# Altium schematic sheet ADC_Interface.SchDoc
size A4; SheetNumber: 9; SheetTotal: 13
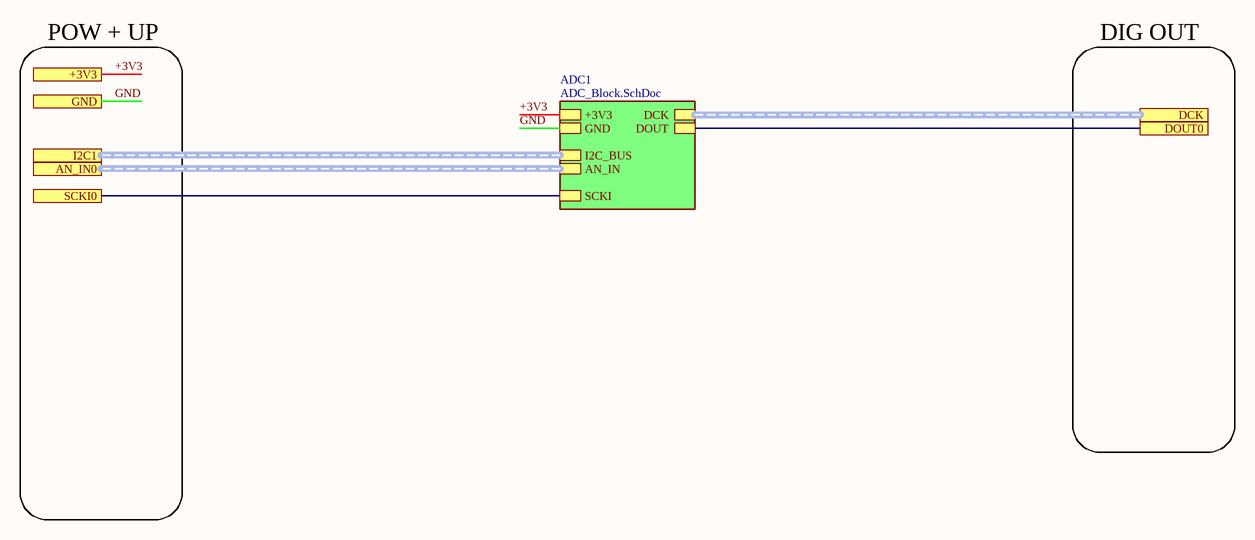
[diagram p0: ADC_Interface.SchDoc]

## Sub-sheets
ADC1 = ADC_Block.SchDoc: +3V3, GND, I2C_BUS (harness I2C), AN_IN (harness AN), SCKI, DCK (harness DCK), DOUT

## Ports
+3V3 (see AudioDSP-v3.0.0c_top[4B], ADC_Block[1A], CTRL_Connectors[1A], DAC_Block[1B], DSP_Block[1A], MCU_Block[1A], PLL_Block[1A], POW_Block[4B]), AN_IN0 (harness AN, see AudioDSP-v3.0.0c_top[4B]), DCK (harness DCK, see AudioDSP-v3.0.0c_top[4B], ADC_Block[4B]), DOUT0 (see AudioDSP-v3.0.0c_top[4B]), GND (see AudioDSP-v3.0.0c_top[4B], ADC_Block[1B], CTRL_Connectors[1A], DAC_Block[1B], DSP_Block[1A], IN_Connectors[3A], LPF_Block[1B], LPF_Interface[1B], MCU_Block[1B], OUT_Connectors[3B], PLL_Block[1A], POW_Block[1B]), I2C1 (harness I2C, see AudioDSP-v3.0.0c_top[4B]), SCKI0 (see AudioDSP-v3.0.0c_top[4B])

## Nets
+3V3: port +3V3, sheet ADC1/+3V3
DOUT0: port DOUT0, sheet ADC1/DOUT
GND: port GND, sheet ADC1/GND
SCKI0: port SCKI0, sheet ADC1/SCKI

## Buses and harness runs
harness port AN_IN0 = sheet ADC1/AN_IN
harness port DCK = sheet ADC1/DCK
harness port I2C1 = sheet ADC1/I2C_BUS

## Notes on the sheet
- POW + UP
- DIG OUT